# EAGLE board 1908011900-Dev Board (EAGLE 9.5.0)
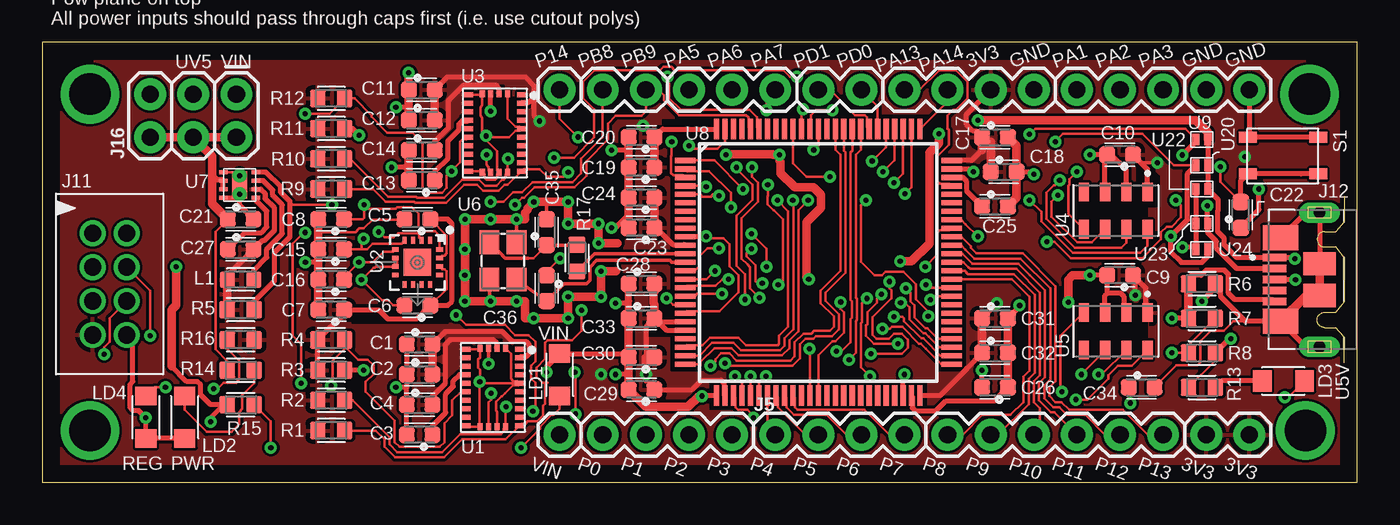
[diagram p3: board, top side]
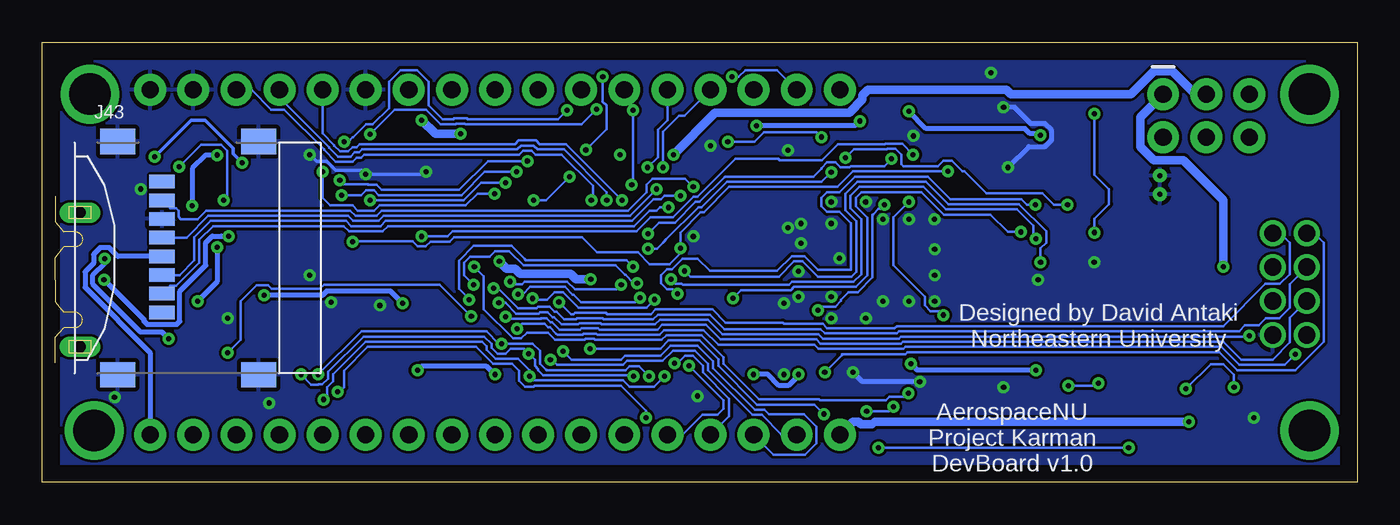
[diagram p4: board, bottom side, seen from below]

Size 77.47 x 25.91 mm. Coordinates in mm from the lower left corner, seen from the top.
Outline: 0,0 77.47,0 77.47,25.91 0,25.91 0,0
Copper layers (1*16): Top 0.035mm / dielectric 1.5mm / Bottom 0.035mm
Design rules "default *": minimum track width 6mil, minimum drill 0.3mm, track to track 6mil, track to pad 6mil, pad to pad 6mil, via to via 6mil, smd to smd 6mil, copper to edge 40mil, drill to drill 6mil, minimum pad ring 10mil, minimum via ring 8mil, stop-mask expansion 4mil, vias tented up to drill 0mil, thermal gap 10mil

## Footprints (pad centres in the part's own frame; a part is rotated, then mirrored left to right if it is on the bottom)
CAPC1608X95N = smd 0.95 x 0.97: 1 -0.76,0; 2 0.76,0
1X02 = drill 1.016 pad 1.88: 1 0,0; 2 2.54,0
1X04 = drill 1.016 pad 1.88: 1 0,0; 2 2.54,0; 3 5.08,0; 4 7.62,0
1X03 = drill 1.016 pad 1.88: 1 0,0; 2 2.54,0; 3 5.08,0
1X06 = drill 1.016 pad 1.88: 1 0,0; 2 2.54,0; 3 5.08,0; 4 7.62,0; 5 10.16,0; 6 12.7,0
87831-0819 = drill 1.016: 1 8.325,4.15; 2 6.325,4.15; 3 4.325,4.15; 4 2.325,4.15; 5 8.325,2.15; 6 6.325,2.15; 7 4.325,2.15; 8 2.325,2.15
MOLEX_105164-0001 = smd 0.45 x 1.38: 1 1.3,4.11; 2 0.65,4.11; 3 0,4.11; 4 -0.65,4.11; 5 -1.3,4.11 | drill 0.7 long: SH1 -3.95,1.45; SH6 3.95,1.45 | smd 1.475 x 2.1: SH2 -2.462,3.75; SH5 2.462,3.75 | smd 1.375 x 1.9: SH3 -0.938,1.45; SH4 0.938,1.45
1X01 = drill 1.016 pad 1.88: 1 0,0
2X3 = drill 1.016 pad 1.88: 1 0,0; 2 0,2.54; 3 2.54,0; 4 2.54,2.54; 5 5.08,0; 6 5.08,2.54
MOLEX_47219-2001 = smd 0.8 x 1.5: 1 3.2,-2.1; 2 2.1,-2.1; 3 1,-2.1; 4 -0.1,-2.1; 5 -1.2,-2.1; 6 -2.3,-2.1; 7 -3.4,-2.1; 8 -4.5,-2.1 | smd 1.5 x 2.05: G1 6.875,-4.7; G2 6.875,3.6; G3 -6.875,3.6; G4 -6.875,-4.7
INDC1608X95N = smd 0.9 x 0.97: 1 -0.785,0; 2 0.785,0
0805_LED = smd 1.1 x 1.25: A 0,0; C 2.5,0
RESC1608X50N = smd 0.94 x 1.02: 1 -0.79,0; 2 0.79,0
SKRPANE010 = smd 1.05 x 0.65: 1 0,2.15; 2 4.15,2.15; 3 0,0; 4 4.15,0
LGA28R50P4X10_380X520X100 = smd 0.3 x 0.525: 1 -2.25,1.562; 6 -2.25,-1.562; 7 -1.75,-1.562; 8 -1.25,-1.562; 9 -0.75,-1.562; 10 -0.25,-1.562; 11 0.25,-1.562; 12 0.75,-1.562; 13 1.25,-1.562; 14 1.75,-1.562; 15 2.25,-1.562; 20 2.25,1.562; 21 1.75,1.562; 22 1.25,1.562; 23 0.75,1.562; 24 0.25,1.562; 25 -0.25,1.562; 26 -0.75,1.562; 27 -1.25,1.562; 28 -1.75,1.562 | smd 0.425 x 0.3: 2 -2.312,0.75; 3 -2.312,0.25; 4 -2.312,-0.25; 5 -2.312,-0.75; 16 2.312,-0.75; 17 2.312,-0.25; 18 2.312,0.25; 19 2.312,0.75
LFCSP-16-3X3 = smd 0.4 x 0.25: 1 -1.3,0.75; 2 -1.3,0.25; 3 -1.3,-0.25; 4 -1.3,-0.75; 9 1.3,-0.75; 10 1.3,-0.25; 11 1.3,0.25; 12 1.3,0.75 | smd 0.25 x 0.4: 5 -0.75,-1.3; 6 -0.25,-1.3; 7 0.25,-1.3; 8 0.75,-1.3; 13 0.75,1.3; 14 0.25,1.3; 15 -0.25,1.3; 16 -0.75,1.3 | smd 1.6 x 1.6: EXP 0,0
TE_MS860702BA01-50 = smd 1.1 x 0.6: 1 -1.1,1.875; 2 -1.1,0.625; 3 -1.1,-0.625; 4 -1.1,-1.875; 5 1.1,-1.875; 6 1.1,-0.625; 7 1.1,0.625; 8 1.1,1.875
TSX-3225 = smd 1.4 x 1.15: 1 0,0; 2 2.2,0; 3 2.2,1.6; 4 0,1.6
TPS62172 = smd 0.5 x 0.25: 1 -0.01,1.5; 2 -0.01,1; 3 -0.01,0.5; 4 -0.01,0; 5 1.9,0; 6 1.9,0.5; 7 1.9,1; 8 1.9,1.5 | smd 0.9 x 1.6: THERMAL@1 0.95,0.75 | drill 0.3: THERMAL@2 0.95,1.3; THERMAL@3 0.95,0.2
LQFP100_14X14 = smd 1.2 x 0.3: 1 -7.85,6; 2 -7.85,5.5; 3 -7.85,5; 4 -7.85,4.5; 5 -7.85,4; 6 -7.85,3.5; 7 -7.85,3; 8 -7.85,2.5; 9 -7.85,2; 10 -7.85,1.5; 11 -7.85,1; 12 -7.85,0.5; 13 -7.85,0; 14 -7.85,-0.5; 15 -7.85,-1; 16 -7.85,-1.5; 17 -7.85,-2; 18 -7.85,-2.5; 19 -7.85,-3; 20 -7.85,-3.5; 21 -7.85,-4; 22 -7.85,-4.5; 23 -7.85,-5; 24 -7.85,-5.5; 25 -7.85,-6; 51 7.85,-6; 52 7.85,-5.5; 53 7.85,-5; 54 7.85,-4.5; 55 7.85,-4; 56 7.85,-3.5; 57 7.85,-3; 58 7.85,-2.5; 59 7.85,-2; 60 7.85,-1.5; 61 7.85,-1; 62 7.85,-0.5; 63 7.85,0; 64 7.85,0.5; 65 7.85,1; 66 7.85,1.5; 67 7.85,2; 68 7.85,2.5; 69 7.85,3; 70 7.85,3.5; 71 7.85,4; 72 7.85,4.5; 73 7.85,5; 74 7.85,5.5; 75 7.85,6 | smd 0.3 x 1.2: 26 -6,-7.85; 27 -5.5,-7.85; 28 -5,-7.85; 29 -4.5,-7.85; 30 -4,-7.85; 31 -3.5,-7.85; 32 -3,-7.85; 33 -2.5,-7.85; 34 -2,-7.85; 35 -1.5,-7.85; 36 -1,-7.85; 37 -0.5,-7.85; 38 0,-7.85; 39 0.5,-7.85; 40 1,-7.85; 41 1.5,-7.85; 42 2,-7.85; 43 2.5,-7.85; 44 3,-7.85; 45 3.5,-7.85; 46 4,-7.85; 47 4.5,-7.85; 48 5,-7.85; 49 5.5,-7.85; 50 6,-7.85; 76 6,7.85; 77 5.5,7.85; 78 5,7.85; 79 4.5,7.85; 80 4,7.85; 81 3.5,7.85; 82 3,7.85; 83 2.5,7.85; 84 2,7.85; 85 1.5,7.85; 86 1,7.85; 87 0.5,7.85; 88 0,7.85; 89 -0.5,7.85; 90 -1,7.85; 91 -1.5,7.85; 92 -2,7.85; 93 -2.5,7.85; 94 -3,7.85; 95 -3.5,7.85; 96 -4,7.85; 97 -4.5,7.85; 98 -5,7.85; 99 -5.5,7.85; 100 -6,7.85
SOD882 = smd 0.4 x 0.7: 1 -0.35,0; 2 0.35,0

## Placement (x,y rotation side)
C1  120nF  [CAPC1608X95N]  22.23,8.13 0 top
C2  6.8nF  [CAPC1608X95N]  22.23,6.35 0 top
C3  100nF  [CAPC1608X95N]  22.23,2.79 180 top
C4  100nF  [CAPC1608X95N]  22.23,4.57 0 top
C5  100nF  [CAPC1608X95N]  22.1,15.49 180 top
C6  100nF  [CAPC1608X95N]  22.1,10.41 180 top
C7  10uF  [CAPC1608X95N]  17.02,10.16 180 top
C8  .005uF  [CAPC1608X95N]  17.02,15.49 180 top
C9  100nF  [CAPC1608X95N]  63.5,12.19 180 top
C10  100nF  [CAPC1608X95N]  63.5,19.3 180 top
C11  120nF  [CAPC1608X95N]  22.35,23.11 0 top
C12  6.8nF  [CAPC1608X95N]  22.35,21.34 0 top
C13  100nF  [CAPC1608X95N]  22.35,17.78 180 top
C14  100nF  [CAPC1608X95N]  22.35,19.56 0 top
C15  .005uF  [CAPC1608X95N]  17.02,13.72 180 top
C16  .005uF  [CAPC1608X95N]  17.02,11.94 180 top
C17  100nF  [CAPC1608X95N]  56.13,20.32 0 top
C18  4.7uF  [CAPC1608X95N]  56.64,18.29 0 top
C19  100nF  [CAPC1608X95N]  35.31,18.54 180 top
C20  4.7uF  [CAPC1608X95N]  35.31,20.32 180 top
C21  10 uF  [CAPC1608X95N]  11.68,15.49 0 top
C22  100nF  [CAPC1608X95N]  70.61,15.75 90 top
C23  100nF  [CAPC1608X95N]  35.31,14.99 180 top
C24  4.7uF  [CAPC1608X95N]  35.31,16.76 180 top
C25  2.2uF  [CAPC1608X95N]  56.13,16.26 0 top
C26  2.2uF  [CAPC1608X95N]  56.13,5.59 180 top
C27  22uF  [CAPC1608X95N]  11.68,13.72 0 top
C28  1uF  [CAPC1608X95N]  35.31,11.68 0 top
C29  100nF  [CAPC1608X95N]  35.31,5.46 180 top
C30  4.7uF  [CAPC1608X95N]  35.31,7.37 180 top
C31  100nF  [CAPC1608X95N]  56.13,9.65 0 top
C32  4.7uF  [CAPC1608X95N]  56.13,7.62 0 top
C33  10nF  [CAPC1608X95N]  35.31,9.65 0 top
C34  4.7nF  [CAPC1608X95N]  64.77,5.59 0 top
C35  4pF  [CAPC1608X95N]  29.72,14.73 90 top
C36  4pF  [CAPC1608X95N]  29.72,11.43 270 top
J1  I2C1  [1X02]  33.02,23.11 0 top
J2  P0-P3  [1X04]  33.02,2.79 0 top
J3  A0-A3  [1X03]  60.96,23.11 0 top
J4  Debug  [1X04]  50.8,23.11 0 top
J5  P4-P7  [1X04]  43.18,2.79 0 top
J6  VCC  [1X02]  68.58,2.79 0 top
J7  GND  [1X02]  68.58,23.11 0 top
J8  SPI1  [1X03]  38.1,23.11 0 top
J9  UART5  [1X02]  45.72,23.11 0 top
J10  P8-P13  [1X06]  53.34,2.79 0 top
J11  [87831-0819]  7.11,6.35 90 top
J12  105164-0001  [MOLEX_105164-0001]  76.71,11.94 90 top
J13  VIN  [1X01]  30.48,2.79 0 top
J14  [1X01]  30.48,23.11 0 top
J16  Header 3x2  [2X3]  11.43,22.86 180 top
J43  47219-2001  [MOLEX_47219-2001]  68.33,13.21 270 bottom
L1  2.2uH  [INDC1608X95N]  11.68,11.94 180 top
LD1  VIN  [0805_LED]  30.48,5.08 90 top
LD2  PWR  [0805_LED]  8.38,5.08 270 top
LD3  U5V  [0805_LED]  71.88,5.97 0 top
LD4  REG  [0805_LED]  6.1,5.08 270 top
R1  40kΩ  [RESC1608X50N]  17.02,3.05 180 top
R2  40kΩ  [RESC1608X50N]  17.02,4.83 180 top
R3  10kΩ  [RESC1608X50N]  17.02,6.6 180 top
R4  10kΩ  [RESC1608X50N]  17.02,8.38 180 top
R5  100k  [RESC1608X50N]  11.68,10.16 180 top
R6  1M  [RESC1608X50N]  68.33,11.68 180 top
R7  59k  [RESC1608X50N]  68.33,9.65 0 top
R8  42.2k  [RESC1608X50N]  68.33,7.62 0 top
R9  40kΩ  [RESC1608X50N]  17.02,17.27 180 top
R10  40kΩ  [RESC1608X50N]  17.02,19.05 180 top
R11  10kΩ  [RESC1608X50N]  17.02,20.83 180 top
R12  10kΩ  [RESC1608X50N]  17.02,22.61 180 top
R13  [RESC1608X50N]  68.33,5.59 0 top
R14  [RESC1608X50N]  11.68,6.6 0 top
R15  [RESC1608X50N]  11.68,4.57 0 top
R16  [RESC1608X50N]  11.68,8.38 180 top
R17  [RESC1608X50N]  31.5,13.21 270 top
S1  SKRPANE010  [SKRPANE010]  75.18,20.32 180 top
U1  BNO055  [LGA28R50P4X10_380X520X100]  26.54,5.59 270 top
U2  ADXL377  [LFCSP-16-3X3]  22.1,12.95 270 top
U3  BNO055  [LGA28R50P4X10_380X520X100]  26.67,20.57 270 top
U4  MS5607-02BA03  [TE_MS860702BA01-50]  63.25,16 270 top
U5  MS5607-02BA03  [TE_MS860702BA01-50]  63.25,8.89 270 top
U6  TSX-3225  [TSX-3225]  27.94,11.94 90 top
U7  TPS62172  [TPS62172]  10.67,16.76 0 top
U8  STM32F767VIT6  [LQFP100_14X14]  45.72,12.95 0 top
U9  PESD3V3S1UL  [SOD882]  68.33,20.19 0 top
U20  PESD3V3S1UL  [SOD882]  68.33,18.67 0 top
U22  PESD3V3S1UL  [SOD882]  68.33,17.27 0 top
U23  PESD3V3S1UL  [SOD882]  68.33,15.24 0 top
U24  PESD3V3S1UL  [SOD882]  68.33,13.72 0 top

## Tracks (layer width: path | path; a pad name or v marks a point on that pad's centre or on a via)
3V3  (via drill 0.3)
  Top 0.152: C30.1 35.56,7.37 | U2.15 23.54,13.35 23.69,13.35 23.83,13.48 23.83,14.53 C5.1 | U2.14 23.54,12.56 23.69,12.56 23.83,12.42 23.83,11.38 C6.1 | C7.1 17.78,9.93 | C29.1 35.56,5.97
  Top 0.203: C10.1 64.74,18.83 v65.69,18.83
  Top 0.305: C9.1 64.39,12.06 | 64.39,12.06 64.77,11.68 65.02,11.43 65.02,10.09 U5.1 | 36.16,14.99 C23.1 36.16,14.99 | C33.2 36.26,9.45 U8.20 | C33.2 36.76,8.95 U8.21 | U8.27 40.18,5.15 40.18,5.83 40,6.01 38.83,6.01 38.28,5.46 C29.1 | C32.1 54.48,6.72 54.48,6.68 52.9,5.1 U8.50 | 55.88,20.07 55.37,19.56 54.77,18.95 U8.75 | U8.11 37.83,14 37.15,14 36.16,14.99 | U8.100 36.55,20.8 C20.1 35.39,20.99 v35.39,21.01 | C14.2 23.11,20.06 23.93,20.88 23.93,22.49 24.84,23.4 26.7,23.4 26.88,23.22 26.88,22.93 U3.3 | U1.3 26.75,7.95 26.75,8.24 26.57,8.42 24.72,8.42 24.04,8.42 23.75,8.13 23.75,5.84 22.98,5.08 C4.2 | C1.2 23.75,8.89 27.1,8.89 27.71,8.28 27.72,8.29 28.49,8.29 28.67,8.11 28.67,7.56 28.59,7.48 28.49,7.38 28.15,7.38 U1.28 | C11.2 23.87,23.88 28.45,23.88 28.96,23.37 28.96,22.86 | U3.28 28.28,22.37 28.62,22.37 28.96,22.7 28.96,22.86 | C5.1 23.88,15.49 24.13,15.24 24.13,10.67 23.88,10.41 C6.1 22.07,9.62 20.35,9.62 19.81,10.16 C7.1 17.78,9.93 R4.2 R3.2 | L1.2 10.9,12.17 C27.2 12.97,14.25 13.1,14.25 13.68,14.83 13.68,16.16 13.12,16.71 13.12,17.02 12.87,17.26 U7.6 | U4.1 65.12,18.44 C10.1 | C33.2 35.56,9.15 35.56,7.37 | C17.1 55.02,20.68 54.84,20.68 54.46,21.06 54.46,21.69 J4.3 | C31.1 56.25,10.53 v56.25,10.55 | v64.41,11.01 64.41,12.04 64.39,12.06 | 35.56,5.97 v35.56,6.35 | v29.3,21.28 28.96,21.62 28.96,22.86
  Top 0.508: v35.56,6.35 35.56,7.36 35.56,7.37 | C32.1 C31.1 | C18.1 55.88,20.07 | 55.37,19.56 C17.1 | C20.1 C19.1 | C23.1 36.07,15.75 C24.1 | C12.2 C11.2 | C2.2 C1.2 | R5.2 L1.2 | C28.2 36.07,11.22 36.01,11.16 36.01,10.53 36.07,10.47 C33.2
  Bottom 0.203: v65.69,18.83 66.22,19.36 66.22,19.67 67.88,21.34 68.71,21.34 v70.87,19.18
  Bottom 0.305: J43.4 73.02,13.31 73.53,13.81 74.08,13.81 74.46,13.43 74.46,12.9 74.96,12.4 74.96,11.48 71.12,7.64 J6.2 | v64.41,11.01 60.96,11.01 60.73,11.25 56.96,11.25 v56.25,10.55 | v32.92,6.35 33.12,6.15 33.12,6.08 33.51,5.69 34.05,5.69 34.71,6.35 v35.56,6.35 | v29.3,21.28 29.57,21.01 v35.39,21.01
  pour Top: 1.02,24.89 76.71,24.89 76.71,1.02 1.02,1.02
A0_PA1  (via drill 0.3)
  Top 0.152: v43.31,16.61 43.94,15.97 43.94,9.15 43.41,8.62 43.41,8.15 43.34,8.08 41.45,8.08 41.02,8.51 39.34,8.51 38.91,8.07 37.99,8.07 U8.23
  Bottom 0.152: v43.31,16.61 46.61,19.91 48.16,19.91 48.39,20.14 49.4,20.14 49.62,19.91 58.77,19.91 58.94,19.74 59.2,19.74 59.45,19.48 59.93,19.48 60.27,19.83 60.27,19.86 60.96,20.55 J3.1
A1_PA2  (via drill 0.3)
  Top 0.152: v44.22,16.61 44.25,16.58 44.25,9.03 43.72,8.49 43.72,8.03 43.46,7.77 41.16,7.77 40.73,8.2 39.47,8.2 38.72,7.45 U8.24
  Bottom 0.152: J3.2 63.5,22.66 60.58,19.73 60.58,19.7 60.06,19.18 59.32,19.18 59.07,19.43 58.81,19.43 58.64,19.61 49.5,19.61 49.27,19.84 48.52,19.84 48.29,19.61 46.74,19.61 44.22,17.09 v44.22,16.61
A2_PA3  (via drill 0.3)
  Top 0.152: v45.12,16.61 44.55,16.04 44.55,8.9 44.02,8.37 44.02,7.9 43.59,7.47 41.03,7.47 40.6,7.9 39.59,7.9 38.79,7.1 38.79,6.86 38.7,6.95 U8.25
  Bottom 0.152: J3.3 65.15,23.11 63.98,21.95 63.22,21.95 60.88,19.61 60.88,19.57 60.18,18.88 59.2,18.88 58.94,19.13 58.69,19.13 58.51,19.3 49.37,19.3 49.15,19.53 48.64,19.53 48.42,19.3 46.86,19.3 45.02,17.46 45.02,16.71 v45.12,16.61
ADRSEL1_PA8  (via drill 0.3)
  Top 0.152: v52.02,12.7 52.74,13.42 52.74,14.7 52.88,14.83 53.45,14.83 U8.67 | v26.43,5.25 26.43,4.86 26.29,4.72 U1.17
  Bottom 0.152: v52.02,12.7 51.46,12.14 51.46,10.2 49.74,8.47 49.26,8.47 48.91,8.82 47.69,8.82 47.25,8.38 45.53,8.38 45.45,8.46 44.97,8.46 44.9,8.38 40.98,8.38 40.7,8.66 38.63,8.66 37.34,7.37 37.34,6.98 35.24,4.88 31.7,4.88 31.65,4.82 27.77,4.82 27.55,5.04 26.65,5.04 v26.43,5.25
ADRSEL2_PA9  (via drill 0.3)
  Top 0.152: v55.12,14.48 54.4,15.2 54.14,15.45 U8.68 | U3.17 26.3,18.38 26.3,18.57 26.16,18.71 v26.16,19.3
  Bottom 0.152: v55.12,14.48 53.59,14.48 53.29,14.78 42.47,14.78 41.65,15.6 40.32,15.6 39.11,16.82 38.88,16.82 36.64,19.05 34.1,19.05 34.02,18.98 31.53,18.98 30.59,19.91 27.82,19.91 27.8,19.94 26.8,19.94 v26.16,19.3
CS1_PA4  (via drill 0.3)
  Top 0.152: v41.91,3.81 41.91,3.91 41.55,4.28 40.98,4.28 40.84,4.41 40.84,4.98 U8.28 | U5.4 61.32,9.94 61.3,9.94 59.99,8.64 59.99,5.42 v60.08,5.33
  Bottom 0.152: v41.91,3.81 41.91,4.23 43.37,5.69 48.45,5.69 48.52,5.63 49.02,5.63 49.38,5.98 49.38,6.56 49.78,6.97 50.91,6.97 51.91,7.98 58.3,7.98 59.69,6.58 59.69,5.59 59.94,5.33 v60.08,5.33
CS2_PB12  (via drill 0.3)
  Top 0.152: J11.7 3.95,9.67 3.95,8.26 3.65,7.96 v3.65,7.53 | U8.51 52.99,6.95 52.07,7.87 51.77,8.17 51.66,8.17 50.66,9.16 50.06,9.16 49.95,9.05 v49.49,9.05
  Bottom 0.152: v49.49,9.05 49.22,9.33 47.87,9.33 47.66,9.12 47.56,9.12 47.2,8.76 47.12,8.68 45.66,8.68 45.58,8.76 44.84,8.76 44.77,8.69 41.1,8.69 40.83,8.96 38.5,8.96 37.64,8.11 31.99,8.11 31.73,7.85 26.75,7.85 26.62,7.98 8.38,7.98 8,7.98 6.93,6.91 4.27,6.91 v3.65,7.53
CS3_PA15  (via drill 0.3)
  Top 0.152: v50.82,17 51.22,17.39 U8.77 | v60.96,18.29 60.53,17.85 60.53,17.54 60.45,17.46 60.45,15.82 U4.5
  Bottom 0.152: v50.82,17 51.84,17 52.53,16.31 57.61,16.31 57.91,16 58.9,16 59.2,16.31 60.5,16.31 60.96,16.76 v60.96,18.29
CS4_PE3  (via drill 0.3)
  Top 0.152: 37.99,18.33 U8.2 37.99,18.33 | 37.99,18.33 39.27,18.33 40.56,17.04 v40.56,16.18
  Bottom 0.152: J43.2 69.95,11.58 69.58,11.58 68.22,12.94 68.22,14.27 67.41,15.09 67.06,15.09 59.71,15.09 59.41,14.79 57.41,14.79 57.11,15.09 42.6,15.09 41.7,15.98 41.28,15.98 41.07,16.18 v40.56,16.18
CUTOUT
  cutout Top: 37.08,19.3 38.73,19.3 38.73,6.6 37.08,6.6
  cutout Top: 25.53,21.08 25.53,21.59 24.64,21.59 24.64,21.08
  cutout Top: 18.29,10.41 21.59,10.41 22.35,11.18 22.86,11.18 23.11,11.43 23.11,14.48 22.86,14.73 22.1,14.73 22.1,16.26 24.64,16.26 24.64,10.16 23.88,9.4 18.29,9.4
  cutout Top: 65.53,16.26 64.52,16.26 64.52,17.78 64.52,18.29 64.52,18.54 64.77,18.8 65.53,18.8 65.53,18.29 65.79,18.03 65.79,17.78 65.79,16.26
  cutout Top: 38.61,8.64 38.61,9.65 36.83,9.65 36.83,11.18 35.81,11.18 35.81,8.64
  cutout Top (isolate 0.254): 39.37,21.34 36.58,21.34 36.58,19.81 39.37,19.81
CUTOUT1
  cutout Top: 39.37,19.94 39.37,21.59 52.07,21.59 52.07,19.94
CUTOUT2
  cutout Top: 39.37,4.32 39.37,5.97 52.07,5.97 52.07,4.32
CUTOUT3
  cutout Top: 54.36,6.6 52.7,6.6 52.7,19.3 54.36,19.3
CUTOUT4
  cutout Top: 27.18,23.37 26.67,23.37 26.67,22.48 27.18,22.48
CUTOUT5
  cutout Top: 28.7,22.1 28.7,22.61 27.81,22.61 27.81,22.1
CUTOUT6
  cutout Top: 27.05,8.38 26.54,8.38 26.54,7.49 27.05,7.49
CUTOUT7
  cutout Top: 27.81,7.62 27.81,7.11 28.7,7.11 28.7,7.62
GND  (via drill 0.3)
  Top 0.152: C36.1 29.72,12.4 v30.5,13.18 | U3.15 25.86,18.32 U3.16 26.04,18.14 26.04,17.95 26.18,17.82 26.66,17.82 26.8,17.95 26.8,18.14 U3.18 | 27.88,20.7 27.94,20.7 | 27.94,20.7 28.11,20.7 U3.25 28.11,20.95 27.88,20.95 27.42,21.4 U3.2 | U3.6 25.86,22.82 U3.5 25.92,22.21 25.81,22.1 25.81,21.59 25.92,21.48 25.92,20.63 v26.16,20.4 26.16,20.32 | U1.16 25.65,3.28 | 25.65,3.28 25.04,3.28 U1.15 | U1.25 28.11,5.75 28.07,5.72 27.75,5.72 27.27,5.24 27.09,5.06 27.06,5.06 26.73,4.73 26.73,4.21 26.79,4.15 U1.18 | U1.2 27.61,7.58 27.61,6.09 27.75,5.96 27.98,5.96 U1.25 | U1.6 25.73,7.84 U1.5 25.79,7.35 25.68,7.24 25.68,6.73 25.79,6.62 25.79,5.94 | 25.79,5.94 v25.77,5.92 25.77,3.4 25.65,3.28 | C6.2 20.67,10.41 20.37,10.72 20.02,10.72 v18.8,11.94 19.51,12.65 19.59,12.65 19.64,12.7 U2.7 | U3.18 26.8,18.38 | 27.94,20.7 27.88,20.7 | 26.16,20.32 27.49,20.32 27.88,20.7 | U8.19 37.99,10.07 39.89,10.07 41.01,11.2 41.01,12.2 40.48,12.73 40.48,14.03 40.13,14.39 39.21,14.39 v39.12,14.48 | U8.99 40.22,20.1 39.78,19.66 38.26,19.66 v38.1,19.81 | 16.26,14.73 18.45,14.73 18.67,14.96 18.93,14.96 19.44,15.48 21.32,15.48 C5.2 | U3.18 26.8,18.38 | 26.16,20.32 26.16,20.13 26.8,19.49 26.8,18.38 | U1.25 25.89,5.84 25.79,5.94 | C34.1 64.01,4.76 v64.1,4.67 | LD3.C 73.42,5.01 v73.22,5.01 | U7.1 11.42,18.26 U7.THERMAL@2
  Top 0.203: C35.2 29.72,16.51 | C36.1 29.72,12.4 | U6.2 v27.94,15.49 | U6.4 26.34,10.85 26.16,10.67
  Top 0.254: LD4.C v6.1,3.81
  Top 0.305: U2.6 U2.7 | v61.72,12.19 C9.2 62.74,11.12 | C10.2 v61.72,19.3 | U8.10 37.89,14.48 v39.12,14.48 | v38.86,5.08 38.89,5.1 U8.26 | 69.66,12.5 69.09,12.5 | 69.09,12.5 68.58,12.5 68.27,12.19 67.69,12.19 67.54,12.04 R6.2 | U7.4 11.42,16.76 U7.THERMAL@3 | C21.2 11.62,16.32 U7.THERMAL@3 | R7.1 v66.55,9.65 | U4.2 63.87,18.41 62.97,19.3 C10.2 | U4.3 62.62,19.19 C10.2 | U5.3 62.62,11 62.74,11.12 | U5.2 63.75,10.11 63.75,10.92 63.55,11.12 62.74,11.12 | U8.49 51.26,5.06 51.26,4.38 51.44,4.2 52.64,4.2 53.24,4.8 56.1,4.8 C26.1 | J12.5 72.48,10.76 70.26,10.76 69.89,11.12 69.89,12.26 69.66,12.5 | 69.66,12.5 69.09,12.5 | J7.2 71.12,20.41 71.08,20.36 | 71.08,20.36 S1.4 | LD2.C LD4.C | v29.72,6.48 29.72,6.82 LD1.C 34.33,7.58 C30.2 | S1.3 71.12,20.32 71.08,20.36 | C22.1 71.68,16.06 v71.68,17.27 | C1.1 C2.1 21.46,5.59 | U7.THERMAL@1 U7.THERMAL@3 | 34.55,6.35 34.54,6.35 v33.78,6.35 | U8.74 54.7,18.45 v54.86,18.29 | C3.2 C4.1 21.46,5.59 | v6.1,3.81 5.68,4.22 5.34,4.22 5.17,4.4 5.17,5.76 5.33,5.92 5.33,8.3 J11.8 | 16.26,12.95 v15.49,12.95 | 21.59,22.1 v20.83,22.1 | 21.46,5.59 v20.83,5.59 | C31.2 57.58,10.34 v57.58,10.41 | 21.59,18.8 21.34,18.54 v20.57,18.54 | 34.55,15.75 33.78,14.99 v33.53,14.99 | C18.2 58.28,18.29 v58.42,18.15 | 34.55,19.56 v33.53,19.56 | 34.55,10.67 34.42,10.54 v33.78,10.54
  Top 0.406: C33.1 34.55,10.67 C28.1
  Top 0.508: 33.79,12.44 v32.93,12.44 v32.93,10.92 v30.99,10.92 v30.99,9.65 v28.96,9.65 28.45,9.65 28.45,10.67 v27.94,10.67 v26.42,10.67 26.16,10.67 v24.89,10.67 24.89,11.94 v24.89,12.19 v24.89,13.72 24.89,15.45 v24.9,15.49 v26.42,15.49 v27.94,15.49 28.45,15.49 28.45,15.88 28.6,16.04 28.6,16.16 v28.96,16.51 29.72,16.51 29.97,16.51 v30.99,16.51 v30.99,15.24 v32.77,15.24 v32.77,14.09 33.9,14.09 | C23.2 34.55,15.49 34.55,15.75 C24.2 C19.2 34.55,19.56 C20.2 | 34.55,6.35 C29.2 35.56,4.44 38.05,4.44 38.69,5.08 v38.86,5.08 | C31.2 C32.2 C26.1 | C25.2 57.4,16.76 C18.2 57.4,19.81 C17.2 | R6.2 R7.1 | C13.2 21.59,18.8 C14.1 | C12.1 21.59,22.1 C11.1 v21.59,24.13 | C7.2 C16.2 16.26,12.95 C15.2 16.26,14.73 C8.2 | C33.1 C30.2 34.55,6.35 34.54,6.35 | v61.72,12.19 60.71,12.19 60.45,11.94 v60.45,10.59
  Bottom 0.203: v61.72,19.3 61.31,18.89 60.71,18.89 60.2,18.39 59.69,18.39 58.66,18.39 v58.42,18.15 55,18.15 v54.86,18.29
  Bottom 0.305: v25.77,5.92 29.16,5.92 v29.72,6.48 | v20.83,22.1 20.19,22.1 19.23,21.13 18.39,21.13 17.99,20.73 17.99,20.16 18.39,19.76 19.35,19.76 v20.57,18.54
  pour Bottom: 0.51,25.15 76.71,25.15 76.71,0.76 0.51,0.76
MISO1_PA6  (via drill 0.3)
  Top 0.152: U8.30 v41.72,6.23 | v41.8,18.54 41.8,18 42.16,17.64 42.16,16.53 41.2,15.57 41.2,13.18 41.54,12.84 41.71,12.67 41.71,11.42 v42.26,10.87 | v49.45,11.08 49.17,10.81 49.17,10.58 48.61,10.02 48.61,9.31 48.54,9.24 48.54,8.64 49.01,8.16 v50.41,8.16 | U5.6 62.62,7.76 v61.21,6.35
  Bottom 0.152: v41.72,6.23 42.33,6.84 42.88,6.84 43.12,6.6 47.75,6.6 47.77,6.62 47.79,6.62 48.15,6.97 48.15,7.73 48.58,8.17 50.02,8.17 50.02,8.16 v50.41,8.16 | v41.8,18.54 41.2,19.15 41.2,20.78 40.64,21.34 J8.2 | v49.45,11.08 49.42,11.05 49.18,11.05 48.73,11.5 46.67,11.5 46.22,11.05 46.19,11.05 45.72,10.59 42.54,10.59 v42.26,10.87 | v50.41,8.16 50.58,8.16 51.31,8.89 58.67,8.89 v61.21,6.35 | v50.41,8.16 v50.41,8.17 v50.41,8.16
MISO2_PB14  (via drill 0.3)
  Top 0.152: U8.53 52.85,7.95 52.25,8.56 52.03,8.78 51.91,8.78 51.08,9.61 51.08,10.31 50.82,10.57 v50.58,10.57 | v6.35,8.64 6.35,11.29 J11.6
  Bottom 0.152: v50.58,10.57 50.19,10.57 49.56,9.94 48.22,9.94 48.13,10.03 47.7,10.03 47.41,9.73 47.31,9.73 46.87,9.29 45.91,9.29 45.83,9.37 44.59,9.37 44.52,9.3 41.36,9.3 41.08,9.57 38.61,9.57 38.25,9.57 37.39,8.71 31.74,8.71 31.48,8.46 27,8.46 26.88,8.58 6.4,8.58 v6.35,8.64
MISO3_PC11  (via drill 0.3)
  Top 0.152: v49.54,18.28 50.22,18.96 U8.79 | U4.6 61.84,14.12 60.98,14.12 59.46,15.64 59.46,16.53 v59.84,16.91
  Bottom 0.152: v49.54,18.28 51.42,18.28 52.78,16.92 57.65,16.92 57.92,17.19 58.41,17.19 58.69,16.91 v59.84,16.91
MISO4_PE5  (via drill 0.3)
  Top 0.152: U8.4 39.06,17.45 v39.12,17.4
  Bottom 0.152: v39.12,17.4 39.6,17.88 41.53,17.88 41.88,17.52 41.88,17.1 42.98,16 57.49,16 57.79,15.7 59.03,15.7 59.33,16 67.82,16 68.33,15.49 69.31,15.49 69.45,15.63 69.45,16 69.58,16.14 69.95,16.14 J43.7
MOSI1_PA7  (via drill 0.3)
  Top 0.152: U8.31 42.22,5.83 v42.63,6.23 | v62.23,6.35 62.43,6.35 U5.7 | J8.3 42.67,22.61 v42.67,21.91 | v42.74,17.53 42.74,16.87 42.73,16.85 42.73,16.37 43.07,16.03 43.1,16.03 43.64,15.49 43.64,11.91 v43.36,11.64 | v48.81,7.58 50.65,7.58 50.99,7.92 50.99,8.4 50.65,8.74 50.17,8.74 49.89,8.46 49.14,8.46 48.91,8.69 48.91,9.73 50.03,10.84 50.03,11.32 49.92,11.43 v49.92,11.82
  Bottom 0.152: v42.63,6.23 42.69,6.3 47.97,6.3 48.27,6.59 48.27,6.67 48.45,6.85 48.45,7.22 v48.81,7.58 | v62.23,6.35 61.62,5.74 61.21,5.74 61.19,5.77 60.97,5.77 60.63,6.11 60.63,6.5 58.55,8.58 51.43,8.58 50.99,8.14 50.99,7.92 50.65,7.58 50.17,7.58 49.89,7.86 49.1,7.86 v48.81,7.58 | v42.67,21.91 42.67,17.6 v42.74,17.53 | v43.36,11.64 43.64,11.36 46.1,11.36 46.55,11.81 49.06,11.81 49.21,11.67 49.77,11.67 v49.92,11.82 | v48.81,7.58
MOSI2_PB15  (via drill 0.3)
  Top 0.152: U8.54 52.78,8.45 52.15,9.08 52.04,9.08 51.39,9.73 51.39,10.43 51.16,10.66 51.16,11.15 v50.88,11.43
  Bottom 0.152: J11.2 3.97,11.67 3.97,10.26 4.57,9.67 5.37,9.67 5.79,9.24 6.6,9.24 6.95,8.89 27,8.89 27.13,8.76 31.36,8.76 31.61,9.02 37.26,9.02 38.12,9.88 41.21,9.88 41.48,9.6 44.39,9.6 44.47,9.67 45.96,9.67 46.03,9.6 46.74,9.6 47.18,10.04 47.28,10.04 47.58,10.33 48.26,10.33 48.35,10.24 49.43,10.24 50.62,11.43 v50.88,11.43
MOSI3_PC12  (via drill 0.3)
  Top 0.152: v48.9,18.92 49.72,19.75 U8.80 | U4.7 63.87,14.11 63.58,13.82 60.85,13.82 59.16,15.51 59.16,17.05 59.6,17.5 59.66,17.5 v59.94,17.78
  Bottom 0.152: v48.9,18.92 51.2,18.92 52.91,17.22 57.49,17.22 57.79,17.52 58.27,17.52 58.29,17.54 59.7,17.54 v59.94,17.78
MOSI4_PE6  (via drill 0.3)
  Top 0.152: v39.88,16.87 39.8,16.95 39.53,16.95 39.39,16.82 38.88,16.82 38.74,16.95 U8.5
  Bottom 0.152: v39.88,16.87 40.81,16.87 41.02,16.67 41.45,16.67 42.72,15.39 57.23,15.39 57.54,15.09 59.28,15.09 59.58,15.39 67.56,15.39 68.53,14.43 68.53,13.06 69.38,12.21 J43.3
N$1
  Top 0.305: C3.1 22.98,3.32 23.77,4.1 23.77,5.21 24.21,5.65 24.21,5.97 24.57,6.34 U1.9
N$3  (via drill 0.3)
  Top 0.203: U1.4 v26.29,6.99 v26.29,6.98
  Top 0.305: v18.92,6.6 R3.1
  Bottom 0.305: v18.92,6.6 25.91,6.6 v26.29,6.98
N$4
  Top 0.305: C25.1 54.48,17.16 54.48,17.73 54.25,17.95 U8.73
N$5
  Top 0.152: 25.07,21.29 U3.9
  Top 0.305: 25.07,21.29 25.06,21.28 24.72,21.28 24.54,21.1 24.54,20.76 23.89,20.11 23.89,19.09 23.11,18.31 C13.1
N$6  (via drill 0.3)
  Top 0.305: v26.42,21.84 U3.4 | R11.1 18.29,20.83 v18.67,20.45
  Bottom 0.305: v26.42,21.84 25.4,20.83 19.57,20.83 19.28,20.54 18.76,20.54 v18.67,20.45
N$7  (via drill 0.3)
  Top 0.305: U8.48 50.72,6.27 v50.8,6.35 | C26.2 v55.37,6.6
  Bottom 0.305: v50.8,6.35 51.04,6.59 51.06,6.59 51.33,6.86 55.12,6.86 v55.37,6.6
N$8
  Top 0.305: L1.1 12.47,12.49 13.22,13.24 13.22,13.73 14.14,14.64 14.14,16.35 13.58,16.9 13.58,17.21 13.02,17.76 U7.7
N$10  (via drill 0.3)
  Top 0.152: R15.2 13.46,3.58 v13.46,2.03 | LD1.A 30.48,4.32 30.12,3.96 30,3.96 29.31,3.28 29.31,3.15 v28.19,2.03
  Bottom 0.152: v13.46,2.03 v28.19,2.03
N$11
  Top 0.152: R14.2 12.47,5.82 11.78,5.12 11.78,4.32 11.59,4.13 11.59,3.4 11.16,2.97 9.66,2.97 8.38,4.26 LD2.A
N$12
  Top 0.305: C27.1 11.91,14.7 12.91,14.7 13.22,15.02 13.22,15.97 12.57,16.62 U7.5
N$14  (via drill 0.3)
  Top 0.152: C34.2 66.82,6.88 68.05,6.88 68.23,7.07 68.23,8.29 68.86,8.91 69.63,8.91 70.19,9.48 70.89,9.48
  Top 0.305: U22.1 U23.1 U24.1 67.85,13.84 v67.18,13.84 | v68.33,10.67 69.12,11.46 | 69.12,11.46 R6.1 | J12.SH5 74.44,15.89 J12.SH6 J12.SH4 | 69.12,11.46 69.43,11.14 69.43,10.93 70.89,9.48 J12.SH2 74.44,7.99 J12.SH1
  Top 0.508: J12.SH2 74.48,11 J12.SH3 J12.SH4
  Bottom 0.305: v67.18,13.84 67.18,11.81 v68.33,10.67
N$15
  Top 0.152: 28.62,13.18 28.93,13.18 C35.1
  Top 0.203: 28.62,13.18 27.26,13.18 27.11,13.33 27.11,13.37 U6.3 | R17.1 31.47,13.97 C35.1
N$16  (via drill 2.44 pad 1.3)
  other vias: 2.79,3.05
N$18
  Top 0.152: R14.1 10.89,7.13 10.2,7.83 10.2,14.76 C21.1
  Top 0.305: U7.3 U7.2 10.62,17.81 10.31,17.81 10.14,17.97 10,17.97
  Top 0.508: J16.2 J16.4 | J16.4 J16.6 | J16.4 10,19.21 10,17.97 10,16.42 C21.1
N$19  (via drill 2.44 pad 1.3)
  other vias: 74.42,3.05
N$20
  Top 0.305: LD3.A 69.5,5.97 R13.2
N$21  (via drill 2.44 pad 1.3)
  other vias: 74.68,22.86
N$23  (via drill 0.3)
  Top 0.152: R16.2 10.89,7.85 11.59,7.15 11.59,6.05 11.4,5.87 10.69,5.87 10.33,5.51 v10.08,5.51 | LD4.A 6.6,5.59 v7.25,5.59
  Bottom 0.152: v10.08,5.51 8.63,6.96 7.88,6.96 7.25,6.33 v7.25,5.59
N$24  (via drill 2.44 pad 1.3)
  other vias: 2.79,22.86
NRESET  (via drill 0.3)
  Top 0.152: U3.11 24.99,20.2 24.75,20.2 24.62,20.07 24.62,18.85 24.12,18.36 v24.12,18.33 24.09,18.33 23.82,18.05 23.82,17.34 23.54,17.07 22.68,17.07 22.41,17.34 22.41,20.01 21.82,20.6 20.32,20.6 19.4,21.52 19.4,21.59 18.38,22.61 R12.1 16.92,21.72 v15.48,21.72 | U1.11 24.66,5.34 24.15,4.83 24.15,3.94 23.69,3.48 23.69,2.35 23.42,2.08 21.03,2.08 20.76,2.35 20.76,3.62 19.05,5.33 19.05,5.91 19.5,6.36 19.5,6.88 19.17,7.21 18.6,7.21 17.79,8.02 17.79,8.37 R4.1 17.81,7.85 17.11,7.15 17.11,5.77 v17.02,5.68 | v39.88,13.78 39.2,13.78 38.7,13.28 38.7,12.71 38.44,12.45 U8.14 | v15.47,14.71 15.39,14.71 14.73,14.05 14.73,8.63 15.24,8.12 v15.24,5.84 | C22.2 69.41,17.71 v69.41,18.59 | v66.79,16.61 67.09,16.31 67.09,15.61 66.54,15.06 66.26,15.06 65.92,14.72 65.92,14.31 64.82,13.21 60.6,13.21 59.63,14.18 v59.18,14.18
  Top 0.305: S1.1 74.17,18.17 S1.2 70.61,17.75 C22.2
  Bottom 0.152: v24.12,18.33 24.13,18.31 29.7,18.31 30.62,17.4 37,17.4 38.5,15.9 38.68,15.9 39.88,14.71 v39.88,13.78 39.88,13.48 40.51,12.85 41.69,12.85 42.39,13.54 44.78,13.54 45.67,14.43 53.21,14.43 53.47,14.17 54.6,14.17 54.88,13.9 55.36,13.9 55.66,14.19 59.17,14.19 v59.18,14.18 | v15.48,21.72 15.48,18.13 14.62,17.27 14.62,16.38 15.47,15.53 v15.47,14.71 | v69.41,18.59 68.11,19.88 66.93,19.88 66.58,19.53 66.58,16.82 v66.79,16.61 | v17.02,5.68 15.41,5.68 v15.24,5.84
OSC_IN
  Top 0.203: U8.12 32.53,13.45 R17.2
OSC_OUT
  Top 0.203: U6.1 C36.2 30.74,11.69 32.06,11.69 32.26,11.9 32.26,12.68 32.65,13.07 36.97,13.07 37.08,12.95 U8.13
P0_PD2  (via drill 0.3)
  Top 0.152: U8.83 48.22,19.6 47.93,19.3 47.93,10.87 48,10.8 48,9.56 47.93,9.49 47.93,7.62 v47.54,7.23
  Bottom 0.152: J2.1 33.91,2.79 35.08,3.96 35.62,3.96 38.25,6.6 38.25,6.99 39.01,7.74 40.32,7.74 40.92,7.15 43.01,7.15 43.24,6.91 47.15,6.91 47.46,7.23 v47.54,7.23
P1_PD3  (via drill 0.3)
  Top 0.152: U8.84 47.72,19.53 47.62,19.43 47.62,10.75 47.69,10.67 47.69,9.69 47.62,9.62 47.62,8.26 47.09,7.72 v46.79,7.72
  Bottom 0.152: v46.79,7.72 46.28,7.21 43.37,7.21 43.13,7.45 41.05,7.45 40.45,8.05 38.88,8.05 37.95,7.12 37.95,6.72 35.49,4.27 34.92,4.27 34.67,4.01 32.59,4.01 31.85,3.28 31.85,2.31 32.54,1.63 34.39,1.63 J2.2
P2_PD4  (via drill 0.3)
  Top 0.152: U8.85 47.22,19.53 47.32,19.43 47.32,12.45 47.32,12.33 46.15,11.16 46.15,10.68 46.94,9.9 46.94,9.02 46.53,8.61 45.59,8.61 45.44,8.46 44.97,8.46 44.63,8.12 44.63,7.29 44.2,6.86 40.39,6.86 v40.23,7.01
  Bottom 0.152: J2.3 37,3.9 37,4.91 38.56,6.47 38.56,6.86 39.13,7.44 39.62,7.44 40.04,7.01 v40.23,7.01
P3_PD5  (via drill 0.3)
  Top 0.152: U8.86 46.72,19.6 47.01,19.3 47.01,12.95 47.01,12.45 45.85,11.29 45.85,10.55 46.63,9.77 46.63,9.15 46.41,8.92 45.47,8.92 45.31,8.76 44.84,8.76 44.33,8.24 44.33,7.42 44.07,7.16 40.9,7.16 40.47,7.59 39.99,7.59 39.65,7.25 39.65,7.13 v39.37,6.86
  Bottom 0.152: J2.4 39.75,2.79 38.58,3.96 37.69,3.96 37.34,4.32 37.34,4.82 v39.37,6.86 | v39.37,6.86
P4_PC4
  Top 0.152: U8.32 42.72,3.25 J5.1
P5_PC5
  Top 0.152: U8.33 43.34,4.98 43.34,4.41 44.96,2.79 J5.2
P6_PB0
  Top 0.152: U8.34 43.84,4.98 43.84,4.41 44.29,3.96 46.2,3.96 47.37,2.79 J5.3
P7_PB1
  Top 0.152: U8.35 44.34,4.98 44.34,4.41 44.48,4.27 47.5,4.27 48.44,4.27 49.91,2.79 J5.4
P8_PD14
  Top 0.152: U8.61 57.13,11.95 58.17,10.92 58.17,6.57 57.81,6.22 57.81,4.73 57.05,3.96 55.4,3.96 54.23,2.79 J10.1
P9_PD15
  Top 0.152: J10.2 56.31,2.79 58.12,4.6 58.12,6.09 58.47,6.44 58.47,11.05 57.26,12.26 54.54,12.26 54.35,12.45 U8.62
P10_PC6
  Top 0.152: J10.3 58.78,3.15 58.78,4.35 58.42,4.7 58.42,5.96 58.78,6.32 58.78,11.17 57.39,12.56 54.67,12.56 54.57,12.66 54.28,12.95 U8.63
P11_PC7
  Top 0.152: J10.4 59.64,4.12 59.44,4.12 58.73,4.83 58.73,5.84 59.08,6.19 59.08,11.3 58.18,12.2 57.51,12.87 54.8,12.87 54.21,13.45 U8.64
P12_PC8
  Top 0.152: J10.5 62.61,2.79 61.44,3.96 60.38,3.96 59.92,4.42 59.57,4.42 59.03,4.96 59.03,5.71 59.38,6.06 59.38,11.43 | U8.65 54.14,13.95 54.4,13.7 54.92,13.17 57.64,13.17 59.38,11.43 | 59.38,11.43
P13_PC9
  Top 0.152: J10.6 65.15,2.79 63.68,4.27 60.5,4.27 60.04,4.73 59.69,4.73 59.34,5.08 59.34,5.59 59.69,5.94 59.69,11.55 | U8.66 54.14,14.45 54.7,13.89 54.7,13.82 55.05,13.48 57.77,13.48 59.69,11.55 | 59.69,11.55
P14_PE4  (via drill 0.3)
  Top 0.152: U8.3 37.75,18.08 37.17,18.08 37.04,18.21 37.04,19.2 37.08,19.24 v37.08,20.07 | v31.57,20.34 30.48,21.42 J14.1
  Bottom 0.152: v37.08,20.07 35.51,20.07 34.95,20.63 31.86,20.63 v31.57,20.34
PG_PD7  (via drill 0.3)
  Top 0.152: U8.88 45.72,19.85 v45.45,19.57 | v44.45,23.89 44.06,23.89 43.66,24.28 37.26,24.28 37.07,24.47 36.59,24.47 36.4,24.28 32.54,24.28 31.85,23.6 31.85,22.63 32.51,21.97 32.51,20.32 31.32,19.12 v30.14,19.12 | 14.6,16.53 14.78,16.35 v17.06,16.35
  Top 0.305: R5.1 12.47,10.66 13.68,11.86 13.68,13.54 14.6,14.45 14.6,16.53 14.04,17.09 14.04,17.39 13.17,18.26 U7.8
  Bottom 0.152: v44.45,23.89 44.45,22.43 44.24,22.21 44.24,20.79 v45.45,19.57 | v17.06,16.35 17.87,16.35 18.54,17.02 21.84,17.02 23.14,18.31 23.24,18.31 23.87,18.93 24.37,18.93 24.69,18.62 26.72,18.62 26.85,18.75 26.85,19.29 27.19,19.63 27.67,19.63 27.7,19.61 29.66,19.61 v30.14,19.12
RX5_PD0
  Top 0.152: J9.2 49.22,22.15 U8.81
RX7_PE7  (via drill 0.3)
  Top 0.152: v45.21,7.87 v45.22,7.87 U8.37 | v31.41,4.02 31.41,6.43 v31.37,6.47
  Bottom 0.152: J11.1 2.54,14.67 1.97,14.1 1.97,8.26 3.63,6.6 7.06,6.6 8.13,7.67 26.5,7.67 26.62,7.55 30.35,7.55 30.35,7.49 v31.37,6.47 | v45.21,7.87 41.06,7.87 40.58,8.35 38.75,8.35 37.64,7.24 37.64,6.85 35.36,4.57 31.97,4.57 v31.41,4.02
SCL1_PA5  (via drill 0.3)
  Top 0.152: U8.29 41.22,5.83 v40.81,6.23 | v48.77,6.23 48.23,6.77 48.23,9.36 48.3,9.43 48.3,10.54 v48.59,10.82 | v40.89,18.54 40.89,18.48 41.86,17.51 41.86,16.66 40.89,15.69 40.89,13.05 40.89,12.75 41.4,12.24 v41.4,10.76 | U5.8 64.19,6.86 63.37,6.86 62.81,6.3 62.81,6.11 61.58,4.87 v60.91,4.87
  Bottom 0.152: v40.81,6.23 41.42,5.63 42.88,5.63 43.25,5.99 48.26,5.99 48.53,5.99 v48.77,6.23 48.77,6.6 49.44,7.27 50.78,7.27 51.3,7.79 51.3,8.02 51.56,8.28 57.91,8.28 58.42,8.28 60.33,6.37 60.33,5.95 60.69,5.59 60.69,5.09 | J8.1 39.62,21.59 39.95,21.59 40.89,20.65 v40.89,18.54 | v48.59,10.82 48.51,10.75 47.73,10.75 47.28,11.2 46.8,11.2 45.88,10.29 41.88,10.29 v41.4,10.76 | 60.69,5.09 v60.91,4.87 60.69,5.09
SCL1_PB8  (via drill 0.3)
  Top 0.152: v27.31,4.45 27.29,4.43 U1.19 27.17,3.15 27.17,2.97 27.04,2.83 24.6,2.83 23.54,1.78 20.91,1.78 20.46,2.23 20.46,2.66 18.29,4.83 R2.1 | U8.95 42.1,20.93 42.1,21.5 41.66,21.94 41.09,21.94 41.08,21.95 37.62,21.95 36.93,22.63 36.93,23.79 v36.83,23.89 | v28.9,4.19 29.05,4.35 29.05,5.85 28.81,6.1 28.81,6.88 29.05,7.12 29.05,8.27 28.65,8.67 27.85,8.67 27.25,9.27 24.97,9.27 v24.39,9.85 | v26.42,16.51 27.18,16.51 27.73,17.07 28.26,17.07 28.87,17.68 31.24,17.68 31.75,18.19 31.75,19.05 33.02,20.32 J1.1
  Bottom 0.152: v26.42,16.51 27.31,15.61 27.31,13.08 27.31,12.78 25.47,10.94 25.47,10.43 25.13,10.09 24.62,10.09 v24.39,9.85 | v36.83,23.89 36.44,23.89 36.04,24.28 34.19,24.28 J1.1 | v28.9,4.19 27.57,4.19 v27.31,4.45
SCL2_PB13  (via drill 0.3)
  Top 0.152: U8.52 52.92,7.45 51.91,8.47 | 51.91,8.47 51.9,8.47 | v50.19,9.74 50.69,9.74 50.78,9.65 50.78,9.48 51.78,8.47 51.9,8.47 | 51.9,8.47 51.91,8.47
  Bottom 0.152: v50.19,9.74 50.08,9.63 48.1,9.63 48.08,9.65 47.76,9.65 47.53,9.43 47.43,9.43 47,8.99 45.78,8.99 45.71,9.06 44.72,9.06 44.65,8.99 41.23,8.99 40.95,9.27 38.38,9.27 37.52,8.41 31.86,8.41 31.61,8.16 26.87,8.16 26.75,8.28 7.88,8.28 6.81,7.21 4.98,7.21 3.95,8.24 3.95,9.68 J11.3
SCL3_PC10  (via drill 0.3)
  Top 0.152: v50.18,17.64 50.72,18.18 U8.78 | U4.8 65.12,13.94 64.69,13.51 60.72,13.51 58.85,15.38 58.85,15.92 v58.17,16.61
  Bottom 0.152: v50.18,17.64 51.63,17.64 52.65,16.61 v58.17,16.61
SCL4_PD12  (via drill 0.3)
  Top 0.152: v27.43,19.05 27.42,19.04 U3.19 27.3,18.14 27.3,17.95 27.16,17.82 27.1,17.82 26.75,17.48 26.09,17.48 25.74,17.82 24.73,17.82 23.67,16.76 22.08,16.76 22.02,16.82 20.36,16.82 18.13,19.05 | U8.59 52.66,10.95 52.46,10.75 v52.32,10.75 | v41.78,14.65 42.67,13.76 v42.67,12.7
  Top 0.305: R10.1 18.13,19.05
  Bottom 0.152: v52.32,10.75 52.32,10.8 52.93,11.41 52.93,13.04 52.05,13.92 49.84,13.92 49.07,13.16 48.99,13.08 43.05,13.08 v42.67,12.7 | v41.78,14.65 41.13,15.3 40.2,15.3 38.98,16.51 38.75,16.51 37.28,17.98 | 37.28,17.98 37.26,18.01 | 37.28,17.98 37.26,18.01 | 37.26,18.01 32.03,18.01 31.57,18.47 31.57,18.5 31.23,18.85 30.75,18.85 30.44,18.54 29.9,18.54 29.83,18.62 27.87,18.62 v27.43,19.05
SCL4_PE2  (via drill 0.3)
  Top 0.152: v41.27,17.27 39.59,18.95 U8.1
  Bottom 0.152: v41.27,17.27 42.85,15.7 57.36,15.7 57.66,15.39 59.15,15.39 59.45,15.7 67.69,15.7 68.98,14.41 J43.5
SDA1_PB9  (via drill 0.3)
  Top 0.152: R1.1 19.64,3.05 20.15,2.53 20.15,2.1 20.78,1.47 23.67,1.47 24.73,2.53 27.3,2.53 U1.20 28.23,3.46 28.45,3.46 | 28.45,3.46 28.46,3.46 | U8.96 41.6,20.93 41.6,21.5 41.47,21.63 37.5,21.63 36.63,22.5 36.63,22.81 36.32,23.11 J1.2 35.56,21.84 35.31,21.59 33.78,21.59 33.33,21.13 33.33,20.19 32.05,18.92 32.05,18.06 31.37,17.38 30.99,17.38 29,17.38 28.39,16.76 28.25,16.76 v27.84,16.35 | 28.45,3.46 28.46,3.46 | 28.46,3.46 28.59,3.58 29.15,3.58 29.5,3.94 29.5,4.5 29.63,4.62 29.63,5.72 29.77,5.87 29.47,5.87 29.11,6.23 29.11,6.75 29.63,7.27 29.63,8.22 29.76,8.36 31.2,8.36 31.77,8.93 v31.77,10.14
  Bottom 0.152: 28.55,15.74 28.5,15.8 | 28.5,15.8 28.19,16.1 27.84,16.1 v27.84,16.35 | 28.5,15.8 28.55,15.74 | 28.55,15.74 28.55,12.07 29.41,11.2 29.97,11.2 30.41,10.76 30.41,10.68 30.75,10.34 31.57,10.34 v31.77,10.14
SDA4_PD13  (via drill 0.3)
  Top 0.152: R9.1 19.48,17.27 20.24,16.51 21.89,16.51 21.95,16.46 23.8,16.46 24.85,17.52 25.62,17.52 25.96,17.17 26.88,17.17 27.22,17.52 27.42,17.52 U3.20 28.35,18.45 29.31,18.45 29.77,17.99 30.71,17.99 v30.99,18.26 | v52.07,11.63 52.25,11.45 U8.60 | v42.42,11.72 42.12,11.72 42.01,11.84 42.01,12.79 41.5,13.3 41.5,13.48 v41.78,13.76
  Bottom 0.152: v52.07,11.63 52.63,12.19 52.63,12.92 52.26,13.28 51.13,13.28 50.8,13.62 49.96,13.62 49.12,12.77 43.69,12.77 43.13,12.22 43.12,12.22 42.63,11.72 v42.42,11.72 | 40.72,14.3 38.81,16.21 38.62,16.21 37.13,17.7 | 40.72,14.3 40.84,14.17 | 40.84,14.17 40.9,14.12 | 40.72,14.3 40.84,14.17 | 40.84,14.17 40.9,14.12 | 40.84,14.17 40.9,14.12 | v41.78,13.76 41.26,13.76 40.9,14.12 | v30.99,18.26 31.55,17.7 37.08,17.7 | 37.08,17.7 37.13,17.7 | 37.08,17.7 37.13,17.7
ST_PC3  (via drill 0.3)
  Top 0.152: U2.2 22.2,14.4 22.2,14.55 22.07,14.68 20.96,14.68 20.7,14.43 20.18,14.43 19.86,14.74 v19.82,14.74 | v36.76,10.85 37.16,10.45 U8.18
  Bottom 0.152: v19.82,14.74 20.58,14.74 21.61,15.77 24.35,15.77 25.67,17.09 29.2,17.09 29.54,16.75 29.54,16.27 28.85,15.58 28.85,12.19 29.54,11.5 33.17,11.5 33.36,11.32 36.07,11.32 36.29,11.32 v36.76,10.85
SWDIO_PA13
  Top 0.152: U8.72 53.45,17.57 52.88,17.57 52.74,17.71 52.74,19.2 53.41,19.87 53.41,20.76 53.34,20.84 53.34,21.59 53.7,21.95 53.82,21.95 54.51,22.63 54.51,23.6 53.82,24.28 52.86,24.28 51.69,23.11 J4.1
SWSLK_PA14
  Top 0.152: J4.2 53.34,22.42 U8.76
TX5_PD1
  Top 0.152: J9.1 46.41,23.11 47.89,21.63 48.47,21.63 48.6,21.5 48.6,20.93 U8.82
TX7_PE8  (via drill 0.3)
  Top 0.152: U8.38 45.72,7.48 46.55,8.31 46.74,8.31 47.24,8.81 47.24,10.02 47.04,10.23 v47.04,10.62
  Bottom 0.152: v47.04,10.62 46.33,9.9 46.16,9.9 46.08,9.98 44.27,9.98 44.2,9.91 41.61,9.91 41.33,10.18 38,10.18 37.21,9.4 33.84,9.4 33.77,9.32 31.48,9.32 31.23,9.07 27.25,9.07 27.13,9.2 7.89,9.2 5.4,11.68 4.55,11.68 3.97,12.26 3.97,14.1 4.54,14.67 J11.5
USB_5V  (via drill 0.3)
  Top 0.152: R13.1 69.12,7.17 R8.2
  Top 0.305: U9.2 U20.2 68.68,18.03 U22.2 69.29,16.66 69.29,16.01 69.25,15.97 69.25,14.77 69.64,14.38 69.64,13.98 69.88,13.74 70.38,13.24 J12.1 73.72,13.24 v73.8,13.16 | R8.2 69.95,8.46 v70.03,8.46
  Top 0.508: v40.29,19.3 40.55,19.3 40.57,19.33 43.04,19.33 43.06,19.3 v43.43,19.3 43.43,18.93 43.5,18.87 43.5,18.22 44.34,17.37 45.44,17.37 45.88,16.92 45.88,16.17 45.03,15.32 45.03,13.46 45.03,12.09 v45.16,11.97 | v52.83,20.52 52.83,19.97 52.26,19.4 52.26,14.05 51.22,13.01 v50.55,13.01 | U9.2 68.68,20.62 67.96,21.34 v55.12,21.34
  Bottom 0.305: v73.8,13.16 73.8,12.91 74.5,12.21 74.5,11.66 71.68,8.85 70.42,8.85 v70.03,8.46
  Bottom 0.508: v40.29,19.3 37.82,21.77 29.92,21.77 29.13,22.56 29.13,22.81 28.83,23.11 20.66,23.11 20.41,22.86 13.33,22.86 11.99,24.21 10.87,24.21 9.53,22.86 J16.3 | v55.12,21.34 54.3,20.52 v52.83,20.52 | v45.16,11.97 46.02,11.97 46.35,12.29 49.32,12.29 49.61,12.58 50.12,12.58 v50.55,13.01
USBD+_PB3  (via drill 0.3)
  Top 0.152: U8.89 45.29,20.88 45.29,21.62 45.58,21.91 v46.56,21.91 | v59.69,20.07 60.15,20.52 64.82,20.52 66.67,18.67 U20.1
  Top 0.305: U24.2 68.68,13.31 68.33,12.96 67.1,12.96 66.5,13.56 v66.5,14.48 67.47,15.45 67.47,18.16 U20.1 | v73.84,11.94 J12.3
  Bottom 0.152: v46.56,21.91 47.08,21.39 52.41,21.39 52.45,21.43 53.21,21.43 53.26,21.39 53.88,21.39 54.71,22.22 54.71,23.37 54.71,23.6 55.4,24.28 56.36,24.28 57.05,23.6 57.05,22.04 58.02,21.08 58.41,21.08 59.16,20.32 59.18,20.32 59.44,20.07 v59.69,20.07
  Bottom 0.305: v66.5,14.48 66.89,14.48 66.91,14.5 67.46,14.5 67.84,14.12 67.84,12.78 69.37,11.25 69.37,9.48 69.55,9.3 71.3,9.3 71.48,9.48 71.48,9.58 v73.84,11.94
USBD-_PB4  (via drill 0.3)
  Top 0.152: U8.90 44.72,21.87 v44.82,21.97 | v58.17,20.5 58.5,20.83 67.34,20.83 67.96,20.21 U9.1
  Top 0.305: v68.63,16.28 68.63,15.28 U23.2 68.68,14.7 69.18,14.19 69.18,13.79 70.38,12.59 J12.2 | v67.18,19.28 67.96,20.05 67.96,20.21
  Bottom 0.152: v58.17,20.5 56.72,21.94 54.86,21.94 54,21.08 53.13,21.08 53.08,21.13 52.58,21.13 52.53,21.08 46.23,21.08 45.71,21.08 v44.82,21.97
  Bottom 0.305: v67.18,19.28 67.85,19.28 68.63,18.49 v68.63,16.28
USBSENSE_PB5  (via drill 0.3)
  Top 0.152: v66.55,7.62 R8.1 67.54,8.07 R7.2 | U8.91 44.22,18.8 45.03,17.99 v46.41,17.99 | v52.2,9.78 52.2,10.05 51.46,10.79 51.46,11.67 50.73,12.4 49.68,12.4 49.47,12.19 49.02,12.19 48.23,12.98 48.23,16.31 v48.53,16.61
  Bottom 0.152: v66.55,7.62 65.79,8.38 65.79,10.67 64.86,11.6 64.17,11.6 63.97,11.39 61.12,11.39 60.88,11.63 54.05,11.63 v52.2,9.78 | v46.41,17.99 47.78,16.61 v48.53,16.61
VIN  (via drill 0.3)
  Top 0.254: v9.91,3.56 9.91,3.81 10.67,4.57
  Top 0.305: R15.1 10.67,4.57 9.91,4.57 9.31,5.17 9.31,5.76 9.13,5.94 8.52,5.94 7.62,6.83
  Top 0.508: 7.62,6.83 7.62,6.86 7.62,10.16 7.87,10.41 v7.87,12.7
  Bottom 0.508: J16.1 12.78,21.51 12.78,19.76 11.99,18.97 10.24,18.97 7.87,16.61 v7.87,12.7 | J13.1 29.72,3.56 29.37,3.56 29.22,3.41 28.57,3.41 28.42,3.56 v9.91,3.56
XOUT_PC0  (via drill 0.3)
  Top 0.152: U2.5 20.68,13.58 20.09,13.58 19.46,12.95 v18.65,12.95 17.78,12.08 C16.1 | U8.15 39.13,11.95 v39.62,12.45
  Bottom 0.152: v18.65,12.95 18.65,13.77 18.32,14.1 18.32,14.78 19.92,16.38 24.09,16.38 25.41,17.7 29.45,17.7 30.15,17 30.15,16.02 29.51,15.38 29.51,14.61 29.52,14.6 29.52,12.39 29.79,12.11 31.78,12.11 32.69,13.02 33.17,13.02 34.08,12.11 39.29,12.11 v39.62,12.45
YOUT_PC1  (via drill 0.3)
  Top 0.152: 18.8,13.72 19.12,13.72 19.47,14.06 21.15,14.06 U2.4 | 18.8,13.72 C15.1 | 18.8,13.72 18.8,14.22 v18.93,14.35 | U8.16 37.99,11.57 39.67,11.57 40.06,11.96 v40.43,11.96
  Bottom 0.152: v18.93,14.35 18.93,14.46 19.09,14.62 19.09,15.12 20.04,16.08 24.22,16.08 25.54,17.4 29.32,17.4 29.84,16.88 29.84,16.14 29.2,15.5 29.2,14.49 29.21,14.48 29.21,12.26 29.67,11.81 33.3,11.81 33.48,11.63 39.73,11.63 39.8,11.7 40.16,11.7 v40.43,11.96
ZOUT_PC2  (via drill 0.3)
  Top 0.152: U2.16 23.4,14.52 23.14,14.78 22.43,14.78 22.15,15.05 22.15,15.82 21.77,16.21 20.91,16.21 20.8,16.1 19.2,16.1 v18.95,16.35 18.95,15.75 18.95,15.59 18.86,15.49 C8.1 | v40.05,11.09 | v40.05,11.09 38.58,11.09 38.44,10.95 U8.17
  Bottom 0.152: v18.95,16.35 19.46,16.35 19.79,16.69 23.97,16.69 25.29,18.01 29.58,18.01 30.49,17.09 31.23,17.09 31.57,16.75 31.57,16.27 31.23,15.93 30.49,15.93 29.82,15.26 29.82,12.52 31.75,12.52 32.56,13.32 33.3,13.32 34.17,12.45 38.14,12.45 38.87,13.17 39.75,13.17 40.38,12.54 40.67,12.54 41.01,12.2 41.01,11.72 40.67,11.38 40.34,11.38 v40.05,11.09

## Text on the board
tPlace: NOTES: / Via drill: 0.3mm / Via Hole: Auto / Ground plane on bottom / Pow plane on top / All power inputs should pass through caps first (i.e. use cutout polys) | UV5 | VIN | P14 | PB8 | PB9 | PA5 | PA6 | PA7 | PD1 | PD0 | PA13 | PA14 | 3V3 | GND | PA1 | PA2 | PA3 | GND | GND | VIN | P0 | P1 | P2 | P3 | P4 | P5 | P6 | P7 | P8 | P9 | P10 | P11 | P12 | P13 | 3V3 | 3V3
bPlace: Designed by David Antaki / Northeastern University | AerospaceNU / Project Karman / DevBoard v1.0